# EAGLE design EmbeddedSystem_BackplaneV1 (EAGLE 7.1.0)
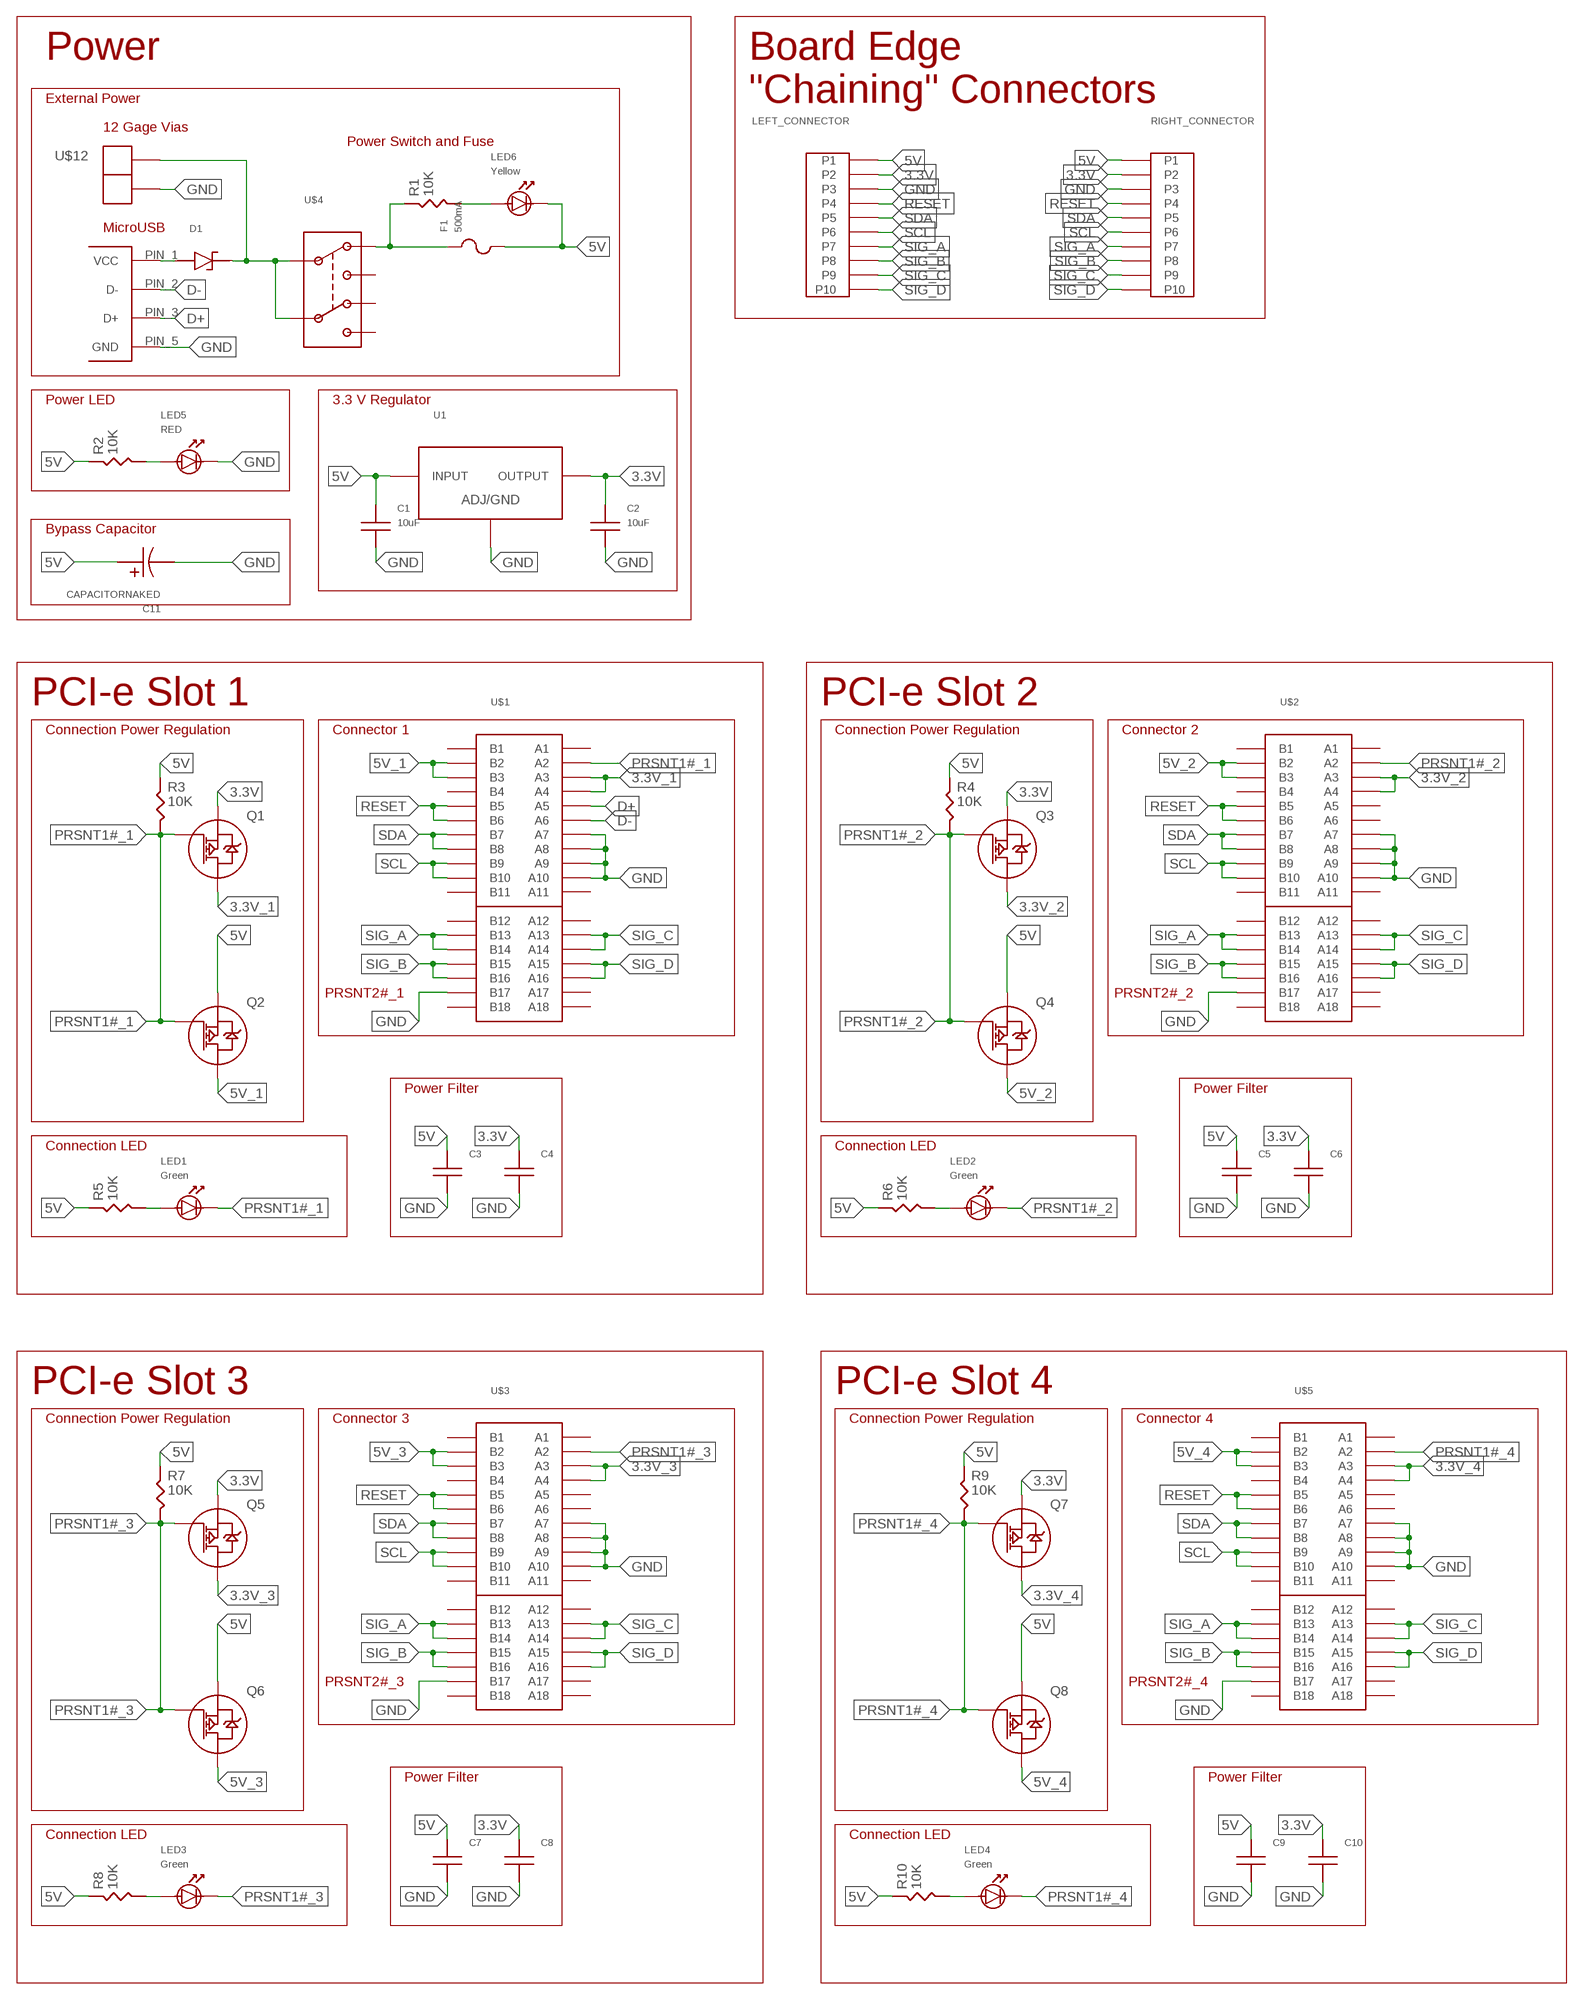
[diagram p0: schematic, sheet 1]

## Parts
C1  10uF  CAPACITOR-UNPOLARIZED0805  [0805_STACKPOLERESISTOR]
C2  10uF  CAPACITOR-UNPOLARIZED0805  [0805_STACKPOLERESISTOR]
C3  CAPACITOR-UNPOLARIZED0805  [0805_STACKPOLERESISTOR]
C4  CAPACITOR-UNPOLARIZED0805  [0805_STACKPOLERESISTOR]
C5  CAPACITOR-UNPOLARIZED0805  [0805_STACKPOLERESISTOR]
C6  CAPACITOR-UNPOLARIZED0805  [0805_STACKPOLERESISTOR]
C7  CAPACITOR-UNPOLARIZED0805  [0805_STACKPOLERESISTOR]
C8  CAPACITOR-UNPOLARIZED0805  [0805_STACKPOLERESISTOR]
C9  CAPACITOR-UNPOLARIZED0805  [0805_STACKPOLERESISTOR]
C10  CAPACITOR-UNPOLARIZED0805  [0805_STACKPOLERESISTOR]
C11  CAPACITORNAKED  [ESK_H4_CAPACITOR_NAKED]
D1  DIODE_SCHOTTKYSOD-123  [SOD-123]
F1  500mA  FUSEC1Q_SMD  [TYPE_C1Q_FUSE]
LED1  Green  LED  [0805_LED]
LED2  Green  LED  [0805_LED]
LED3  Green  LED  [0805_LED]
LED4  Green  LED  [0805_LED]
LED5  RED  LED  [0805_LED]
LED6  Yellow  LED  [0805_LED]
LEFT_CONNECTOR  10PIN-HEADER  [10PIN_HEADER]
Q1  PMOSSOT-23  [SOT-23]
Q2  PMOSSOT-23  [SOT-23]
Q3  PMOSSOT-23  [SOT-23]
Q4  PMOSSOT-23  [SOT-23]
Q5  PMOSSOT-23  [SOT-23]
Q6  PMOSSOT-23  [SOT-23]
Q7  PMOSSOT-23  [SOT-23]
Q8  PMOSSOT-23  [SOT-23]
R1  10K  RESISTOR  [0805_STACKPOLERESISTOR]
R2  10K  RESISTOR  [0805_STACKPOLERESISTOR]
R3  10K  RESISTOR  [0805_STACKPOLERESISTOR]
R4  10K  RESISTOR  [0805_STACKPOLERESISTOR]
R5  10K  RESISTOR  [0805_STACKPOLERESISTOR]
R6  10K  RESISTOR  [0805_STACKPOLERESISTOR]
R7  10K  RESISTOR  [0805_STACKPOLERESISTOR]
R8  10K  RESISTOR  [0805_STACKPOLERESISTOR]
R9  10K  RESISTOR  [0805_STACKPOLERESISTOR]
R10  10K  RESISTOR  [0805_STACKPOLERESISTOR]
RIGHT_CONNECTOR  10PIN-HEADER  [10PIN_HEADER]
U1  VOLTAGE_REGULATOR  [SOT223]
U$1  PCI-E_X1  [PCIE_X1]
U$2  PCI-E_X1  [PCIE_X1]
U$3  PCI-E_X1  [PCIE_X1]
U$4  SWITCH_DPDT  [SWITCH_GF-126]
U$5  PCI-E_X1  [PCIE_X1]
U$10  USBMICROB  [USBMICROB-PAC]
U$12  2PIN-HEADER16GAGE  [2PIN_16GAGE]

## Nets
3.3V: C2.P$1 C4.P$1 C6.P$1 C8.P$1 C10.P$1 LEFT_CONNECTOR.P2 Q1.S Q3.S Q5.S Q7.S RIGHT_CONNECTOR.P2 U1.P2(OUTPUT) U1.TOP(OUTPUT)
3.3V_1: Q1.D U$1.A3 U$1.A4
3.3V_2: Q3.D U$2.A3 U$2.A4
3.3V_3: Q5.D U$3.A3 U$3.A4
3.3V_4: Q7.D U$5.A3 U$5.A4
5V: C1.P$1 C3.P$1 C5.P$1 C7.P$1 C9.P$1 C11.POSITIVE_PAD(POSITIVE_LEAD) F1.P$2 LED6.CATHODE LEFT_CONNECTOR.P1 Q2.S Q4.S Q6.S Q8.S R2.P$1 R3.P$1 R4.P$1 R5.P$1 R6.P$1 R7.P$1 R8.P$1 R9.P$1 R10.P$1 RIGHT_CONNECTOR.P1 U1.P3(INPUT)
5V_1: Q2.D U$1.B2 U$1.B3
5V_2: Q4.D U$2.B2 U$2.B3
5V_3: Q6.D U$3.B2 U$3.B3
5V_4: Q8.D U$5.B2 U$5.B3
5V_SUPPLY: D1.CATHODE U$4.P1_C U$4.P2_C U$12.P1
D+: U$1.A5 U$10.PIN_3(D+)
D-: U$1.A6 U$10.PIN_2(D-)
GND: C1.P$2 C2.P$2 C3.P$2 C4.P$2 C5.P$2 C6.P$2 C7.P$2 C8.P$2 C9.P$2 C10.P$2 C11.NEGATIVE_PAD(NEGATIVE_LEAD) LED5.CATHODE LEFT_CONNECTOR.P3 RIGHT_CONNECTOR.P3 U1.P1(ADJ/GND) U$1.A7 U$1.A8 U$1.A9 U$1.A10 U$1.B17 U$2.A7 U$2.A8 U$2.A9 U$2.A10 U$2.B17 U$3.A7 U$3.A8 U$3.A9 U$3.A10 U$3.B17 U$5.A7 U$5.A8 U$5.A9 U$5.A10 U$5.B17 U$10.PIN_5(GND) U$12.P2
N$1: LED5.ANODE R2.P$2
N$2: F1.P$1 R1.P$1 U$4.P1_1
N$3: LED6.ANODE R1.P$2
N$4: LED1.ANODE R5.P$2
N$5: D1.ANODE U$10.PIN_1(VCC)
N$6: LED2.ANODE R6.P$2
N$7: LED3.ANODE R8.P$2
N$8: LED4.ANODE R10.P$2
PRSNT1#_1: LED1.CATHODE Q1.G(G(1)) Q2.G(G(1)) R3.P$2 U$1.A2
PRSNT1#_2: LED2.CATHODE Q3.G(G(1)) Q4.G(G(1)) R4.P$2 U$2.A2
PRSNT1#_3: LED3.CATHODE Q5.G(G(1)) Q6.G(G(1)) R7.P$2 U$3.A2
PRSNT1#_4: LED4.CATHODE Q7.G(G(1)) Q8.G(G(1)) R9.P$2 U$5.A2
RESET: LEFT_CONNECTOR.P4 RIGHT_CONNECTOR.P4 U$1.B5 U$1.B6 U$2.B5 U$2.B6 U$3.B5 U$3.B6 U$5.B5 U$5.B6
SCL: LEFT_CONNECTOR.P6 RIGHT_CONNECTOR.P6 U$1.B9 U$1.B10 U$2.B9 U$2.B10 U$3.B9 U$3.B10 U$5.B9 U$5.B10
SDA: LEFT_CONNECTOR.P5 RIGHT_CONNECTOR.P5 U$1.B7 U$1.B8 U$2.B7 U$2.B8 U$3.B7 U$3.B8 U$5.B7 U$5.B8
SIG_A: LEFT_CONNECTOR.P7 RIGHT_CONNECTOR.P7 U$1.B13 U$1.B14 U$2.B13 U$2.B14 U$3.B13 U$3.B14 U$5.B13 U$5.B14
SIG_B: LEFT_CONNECTOR.P8 RIGHT_CONNECTOR.P8 U$1.B15 U$1.B16 U$2.B15 U$2.B16 U$3.B15 U$3.B16 U$5.B15 U$5.B16
SIG_C: LEFT_CONNECTOR.P9 RIGHT_CONNECTOR.P9 U$1.A13 U$1.A14 U$2.A13 U$2.A14 U$3.A13 U$3.A14 U$5.A13 U$5.A14
SIG_D: LEFT_CONNECTOR.P10 RIGHT_CONNECTOR.P10 U$1.A15 U$1.A16 U$2.A15 U$2.A16 U$3.A15 U$3.A16 U$5.A15 U$5.A16
Unconnected: U$1.A1 U$1.A11 U$1.A12 U$1.A17 U$1.A18 U$1.B1 U$1.B4 U$1.B11 U$1.B12 U$1.B18 U$2.A1 U$2.A5 U$2.A6 U$2.A11 U$2.A12 U$2.A17 U$2.A18 U$2.B1 U$2.B4 U$2.B11 U$2.B12 U$2.B18 U$3.A1 U$3.A5 U$3.A6 U$3.A11 U$3.A12 U$3.A17 U$3.A18 U$3.B1 U$3.B4 U$3.B11 U$3.B12 U$3.B18 U$4.P1_2 U$4.P2_1 U$4.P2_2 U$5.A1 U$5.A5 U$5.A6 U$5.A11 U$5.A12 U$5.A17 U$5.A18 U$5.B1 U$5.B4 U$5.B11 U$5.B12 U$5.B18

## Notes on the sheet
- Power
- External Power
- Board Edge
  "Chaining" Connectors
- 12 Gage Vias
- Power Switch and Fuse
- MicroUSB
- Power LED | 3.3 V Regulator
- Bypass Capacitor
- PCI-e Slot 1 | PCI-e Slot 2
- Connection Power Regulation | Connector 1 | Connection Power Regulation | Connector 2
- PRSNT2#_1 | PRSNT2#_2
- Power Filter | Power Filter
- Connection LED | Connection LED
- PCI-e Slot 3 | PCI-e Slot 4
- Connection Power Regulation | Connector 3 | Connection Power Regulation | Connector 4
- PRSNT2#_3 | PRSNT2#_4
- Power Filter | Power Filter
- Connection LED | Connection LED

## Library data of the parts
C1-C10 = 000_CustomPartsMaster:CAPACITOR-UNPOLARIZED
C11 = 000_CustomPartsMaster:CAPACITOR
D1 = 000_CustomPartsMaster:DIODE_SCHOTTKY
F1 = 000_CustomPartsMaster:FUSE
LED1-LED6 = 000_CustomPartsMaster:LED
LEFT_CONNECTOR RIGHT_CONNECTOR = 000_CustomPartsMaster:10PIN-HEADER
Q1-Q8 = 000_CustomPartsMaster:PMOS
R1-R10 = 000_CustomPartsMaster:RESISTOR
U1 = 000_CustomPartsMaster:VOLTAGE_REGULATOR
U$1-U$3 U$5 = 000_CustomPartsMaster:PCI-E_X1
U$4 = 000_CustomPartsMaster:SWITCH_DPDT
U$10 = 000_CustomPartsMaster:USBMICROB
U$12 = 000_CustomPartsMaster:2PIN-HEADER

## Board
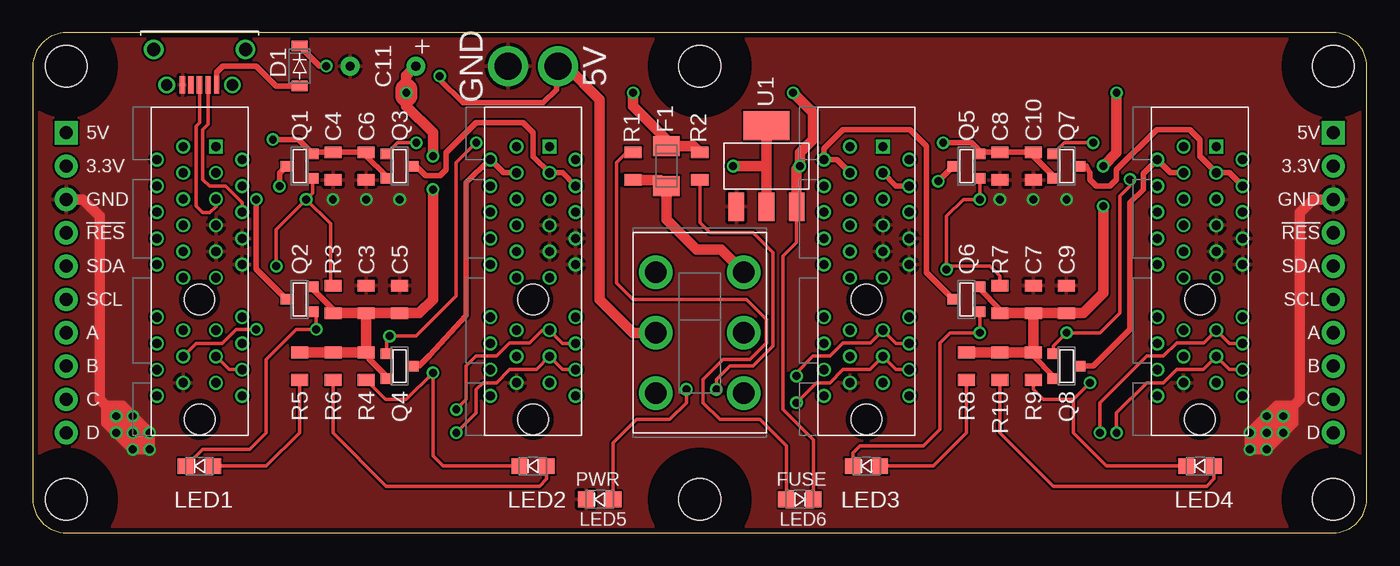
[diagram p1: board, top side]
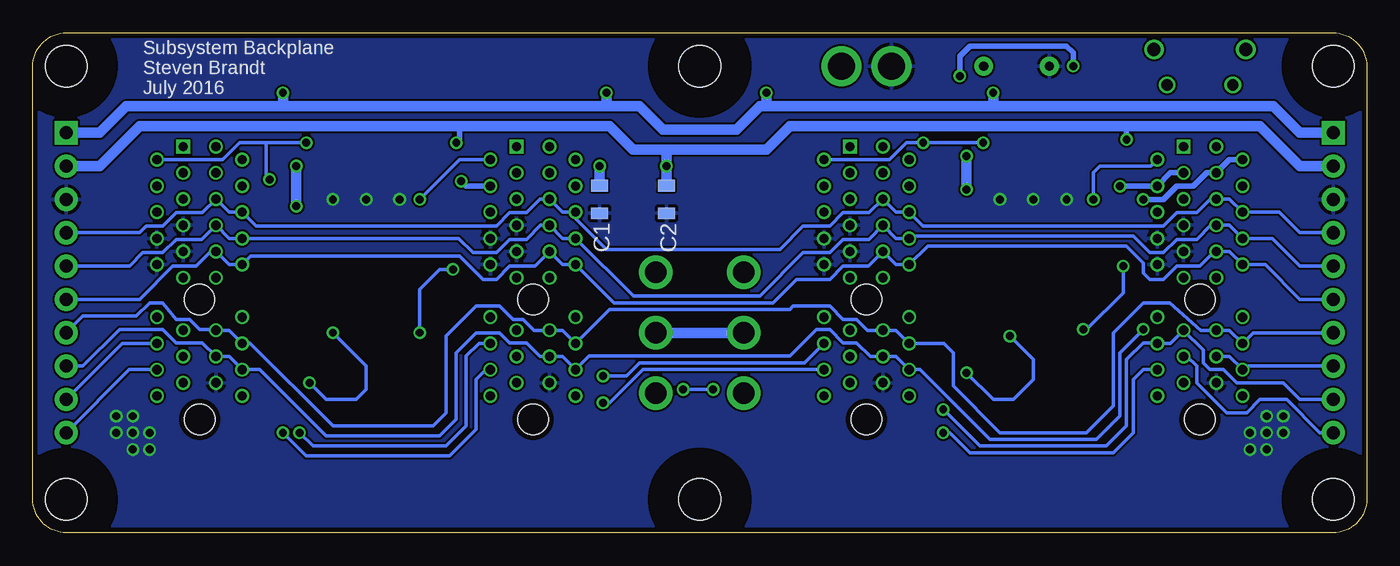
[diagram p2: board, bottom side, seen from below]

Size 101.6 x 38.1 mm. Coordinates in mm from the lower left corner, seen from the top.
Outline: 0,35.56 0,2.54 arc90 2.54,0 99.06,0 arc90 101.6,2.54 101.6,35.56 arc90 99.06,38.1 2.54,38.1 arc90 0,35.56
Copper layers (1*16): Top 0.0356mm / dielectric 1.5011mm / Bottom 0.0356mm
Design rules "oshpark-2layer": minimum track width 6mil, minimum drill 13mil, track to track 6mil, track to pad 6mil, pad to pad 6mil, via to via 6mil, smd to smd 6mil, copper to edge 15mil, drill to drill 6mil, minimum pad ring 7mil, minimum via ring 7mil, stop-mask expansion 4mil, vias tented up to drill 0mil, thermal gap 10mil
Holes 3.17 mm at 2.54,2.54 2.54,35.56 99.06,35.56 99.06,2.54 50.8,2.54 50.8,35.56
tRestrict: area -1.3,31.8 to 6.3,39.4; area -1.3,-1.3 to 6.3,6.3; area 95.2,-1.3 to 102.9,6.3; area 95.2,31.8 to 102.9,39.4; area 47,-1.3 to 54.6,6.3; area 47,31.8 to 54.6,39.4
bRestrict: area -1.3,31.8 to 6.3,39.4; area -1.3,-1.3 to 6.3,6.3; area 95.2,-1.3 to 102.9,6.3; area 95.2,31.8 to 102.9,39.4; area 47,-1.3 to 54.6,6.3; area 47,31.8 to 54.6,39.4

### Footprints (pad centres in the part's own frame; a part is rotated, then mirrored left to right if it is on the bottom)
0805_STACKPOLERESISTOR = smd 0.9 x 1.3: P$1 -1.05,0; P$2 1.05,0
ESK_H4_CAPACITOR_NAKED = drill 0.7 pad 1.422: NEGATIVE_PAD -2.5,0; POSITIVE_PAD 2.5,0
SOD-123 = smd 1.2 x 0.8: ANODE 0,-1.525; CATHODE 0,1.525
TYPE_C1Q_FUSE = smd 1.52 x 2.03: P$1 -1.52,0; P$2 1.52,0
0805_LED = smd 1.2 x 1.2: ANODE -1.05,0; CATHODE 1.05,0
10PIN_HEADER = drill 1 pad 1.778 square: P1 0,11.43 | drill 1 pad 1.778: P2 0,8.89; P3 0,6.35; P4 0,3.81; P5 0,1.27; P6 0,-1.27; P7 0,-3.81; P8 0,-6.35; P9 0,-8.89; P10 0,-11.43
SOT-23 = smd 0.8 x 0.9: D 0,1; G -0.95,-1; S 0.95,-1
SOT223 = smd 1.2 x 2.2: P1 -2.3,-3.1; P2 0,-3.1; P3 2.3,-3.1 | smd 3.5 x 2.2: TOP 0,3.1
PCIE_X1 = drill 0.7 pad 1.016 square: A1 -11.65,1.25 | drill 0.7 pad 1.016: A2 -10.65,3.25; A3 -9.65,1.25; A4 -8.65,3.25; A5 -7.65,1.25; A6 -6.65,3.25; A7 -5.65,1.25; A8 -4.65,3.25; A9 -3.65,1.25; A10 -2.65,3.25; A12 1.35,3.25; A13 2.35,1.25; A14 3.35,3.25; A15 4.35,1.25; A16 5.35,3.25; A17 6.35,1.25; A18 7.35,3.25; B1 -11.65,-1.25; B2 -10.65,-3.25; B3 -9.65,-1.25; B4 -8.65,-3.25; B5 -7.65,-1.25; B6 -6.65,-3.25; B7 -5.65,-1.25; B8 -4.65,-3.25; B9 -3.65,-1.25; B10 -2.65,-3.25; B12 1.35,-3.25; B13 2.35,-1.25; B14 3.35,-3.25; B15 4.35,-1.25; B16 5.35,-3.25; B17 6.35,-1.25; B18 7.35,-3.25 | drill 0.7 pad 0.965: A11 -1.65,1.25; B11 -1.65,-1.25 | hole 2.311: 0,0 | hole 2.35: 9.15,0
SWITCH_GF-126 = drill 1.65 pad 2.54: P1_1 -4.6,3.355; P1_2 4.6,3.355; P1_C 0,3.355; P2_1 -4.6,-3.355; P2_2 4.6,-3.355; P2_C 0,-3.355
USBMICROB-PAC = drill 1: P$1 0,3.5; P$2 0,-3.5 | drill 0.85: P$3 2.7,2.5; P$4 2.7,-2.5 | smd 1.35 x 0.4: PIN_1 2.7,1.3; PIN_2 2.7,0.65; PIN_3 2.7,0; PIN_4 2.7,-0.65; PIN_5 2.7,-1.3
2PIN_16GAGE = drill 2.057: P1 0,1.905; P2 0,-1.905

### Placement (x,y rotation side)
C1  58.42,25.4 270 bottom
C2  53.34,25.4 270 bottom
C3  25.4,17.78 90 top
C4  22.86,27.94 270 top
C5  27.94,17.78 90 top
C6  25.4,27.94 270 top
C7  76.2,17.78 90 top
C8  73.66,27.94 270 top
C9  78.74,17.78 90 top
C10  76.2,27.94 270 top
C11  26.67,35.56 0 top
D1  20.32,35.56 0 top
F1  48.26,27.94 90 top
LED1  12.7,5.08 180 top
LED2  38.1,5.08 180 top
LED3  63.5,5.08 180 top
LED4  88.9,5.08 180 top
LED5  43.18,2.54 180 top
LED6  58.42,2.54 0 top
LEFT_CONNECTOR  2.54,19.05 0 top
Q1  20.32,27.94 90 top
Q2  20.32,17.78 90 top
Q3  27.94,27.94 270 top
Q4  27.94,12.7 270 top
Q5  71.12,27.94 90 top
Q6  71.12,17.78 90 top
Q7  78.74,27.94 270 top
Q8  78.74,12.7 270 top
R1  45.72,27.94 90 top
R2  50.8,27.94 270 top
R3  22.86,17.78 90 top
R4  25.4,12.7 270 top
R5  20.32,12.7 270 top
R6  22.86,12.7 270 top
R7  73.66,17.78 90 top
R8  71.12,12.7 270 top
R9  76.2,12.7 270 top
R10  73.66,12.7 270 top
RIGHT_CONNECTOR  99.06,19.05 0 top
U1  55.88,27.94 0 top
U$1  12.7,17.78 270 top
U$2  38.1,17.78 270 top
U$3  63.5,17.78 270 top
U$4  50.8,15.24 270 top
U$5  88.9,17.78 270 top
U$10  12.7,36.83 270 top
U$12  38.1,35.56 270 top

### Tracks (layer width: path | path; a pad name or v marks a point on that pad's centre or on a via)
3.3V  (via drill 0.6)
  Top 0.406: Q3.S 26.94,27.16 25.4,28.7 C6.P$1 C4.P$1 21.42,28.99 Q1.S 20.24,29.97 v18.29,29.97 | Q5.S 72.22,28.99 | 72.22,28.99 C8.P$1 C10.P$1 76.2,28.7 77.74,27.16 Q7.S | 72.22,28.99 71.49,29.72 v69.34,29.72
  Top 0.813: U1.TOP 55.88,27.94 | 55.88,27.94 U1.P2 | v53.34,27.94 55.88,27.94
  Bottom 0.406: v18.29,29.97 18.29,30.99 | v69.34,29.72 69.09,29.97 69.09,30.99
  Bottom 0.813: LEFT_CONNECTOR.P2 5.08,27.94 8.13,30.99 18.29,30.99 43.94,30.99 45.72,29.21 53.34,29.21 | RIGHT_CONNECTOR.P2 96.52,27.94 93.47,30.99 69.09,30.99 57.66,30.99 55.88,29.21 53.34,29.21 | C2.P$1 v53.34,27.94 53.34,29.21
3.3V_1  (via drill 0.6)
  Top 0.406: v18.8,26.42 18.8,27.42 Q1.D
  Bottom 0.406: v18.8,26.42 18.78,26.43 U$1.A4 14.95,27.43 U$1.A3
3.3V_2
  Top 0.406: U$2.A4 40.35,27.43 U$2.A3 38.1,28.68 38.1,30.48 37.34,31.24 33.78,31.24 31.5,28.96 31.5,27.69 31.03,27.22 29.93,27.22 29.21,27.94 Q3.D
3.3V_3  (via drill 0.6)
  Top 0.406: U$3.A3 65.75,26.43 U$3.A4 | v68.97,26.79 Q5.D
  Bottom 0.406: U$3.A4 68.61,26.43 v68.97,26.79
3.3V_4
  Top 0.406: U$5.A4 91.15,27.43 U$5.A3 88.9,28.7 88.9,29.97 88.14,30.73 85.6,30.73 82.55,27.69 82.55,26.92 82.04,26.42 81.03,26.42 80.52,26.92 80.52,27.43 80.26,27.94 Q7.D
5V  (via drill 0.6)
  Top 0.254: LED6.CATHODE 59.47,7.08 57.15,9.4 57.15,21.08 58.17,22.1 58.17,24.83 U1.P3
  Top 0.406: R4.P$1 25.59,13.75 25.59,13.27 26.94,11.92 Q4.S | R3.P$1 22.86,17.02 21.32,18.56 Q2.S | Q8.S 77.74,11.92 76.2,13.46 R9.P$1 | Q6.S 72.12,18.56 73.66,17.02 R7.P$1
  Top 0.813: C3.P$1 C5.P$1 29.43,16.73 30.48,17.78 v30.48,26.16 | C3.P$1 R3.P$1 | R5.P$1 R6.P$1 R4.P$1 C3.P$1 | v30.48,28.7 30.48,30.48 28.45,32.51 28.45,33.27 v28.45,33.53 28.45,33.78 28.45,34.84 C11.POSITIVE_PAD | R7.P$1 C7.P$1 | C7.P$1 C9.P$1 78.77,16.76 80.01,16.76 81.53,18.29 v81.53,24.89 | R8.P$1 R10.P$1 R9.P$1 C7.P$1 | v81.53,27.94 82.55,28.96 v82.55,33.53 | v57.91,33.53 59.44,32 59.44,29.97 58.42,28.96 v58.42,27.94 58.18,27.7 U1.P3 | R2.P$1 50.33,29.46 F1.P$2 48.26,29.97 45.72,32.51 v45.72,33.53
  Top 1.676: 28.45,33.78 28.45,33.27
  Bottom 0.813: 28.45,32.51 7.11,32.51 5.08,30.48 LEFT_CONNECTOR.P1 | 28.45,32.51 45.72,32.51 | 58.17,32.51 82.55,32.51 | 82.55,32.51 94.49,32.51 96.52,30.48 RIGHT_CONNECTOR.P1 | v30.48,26.16 v30.48,28.7 | v81.53,24.89 v81.53,27.94 | v82.55,33.53 82.55,32.51 | v45.72,33.53 45.72,32.51 | v57.91,33.53 57.91,32.77 58.17,32.51 | v58.42,27.94 C1.P$1 | 45.72,32.51 46.23,32.51 48.01,30.73 53.59,30.73 55.37,32.51 58.17,32.51 | v28.45,33.53 28.45,32.51
5V_1  (via drill 0.6)
  Top 0.406: Q2.D 17.02,20.08 v17.02,25.4
  Bottom 0.406: U$1.B2 10.45,28.43 U$1.B3 12.19,27.43 13.21,26.42 14.48,26.42 15.49,25.4 v17.02,25.4
5V_2
  Top 0.406: U$2.B3 35.85,27.43 U$2.B2 34.78,28.43 33.02,26.67 33.02,16.56 30.23,13.5 29.43,12.7 Q4.D
5V_3
  Top 0.406: Q6.D 68.07,19.83 68.07,29.46 66.8,30.73 61.72,30.73 60.25,29.26 U$3.B2 61.25,28.43 U$3.B3
5V_4
  Top 0.406: U$5.B3 86.65,27.43 U$5.B2 84.58,27.36 84.58,26.16 83.57,25.15 83.57,15.49 80.77,12.7 Q8.D
5V_SUPPLY  (via drill 0.6)
  Top 0.406: v30.99,34.8 30.99,34.54 32.77,32.77 38.86,32.77 39.88,33.78 39.88,35.43 U$12.P1 | D1.CATHODE 21.84,35.56 v22.35,35.56
  Top 0.813: U$12.P1 40.64,35.56 43.18,33.02 43.18,17.78 45.72,15.24 U$4.P2_C
  Bottom 0.406: v30.99,34.8 30.99,36.32 30.23,37.08 22.86,37.08 22.35,36.58 v22.35,35.56
  Bottom 0.813: U$4.P2_C U$4.P1_C
D+
  Top 0.254: U$10.PIN_3 12.7,31.24 12.45,30.99 12.45,24.89 12.95,24.38 13.46,24.38 13.95,24.87 U$1.A5
D-
  Top 0.254: U$1.A6 15.95,25.15 14.68,26.42 13.46,26.42 12.95,26.92 12.95,30.73 13.35,31.13 U$10.PIN_2
GND  (via drill 0.6)
  Top 0.813: RIGHT_CONNECTOR.P3 97.54,25.4 96.52,24.38 96.52,10.16 96.01,9.65 | LEFT_CONNECTOR.P3 3.81,25.4 5.08,24.13 5.08,10.16 5.59,9.65 | 96.01,9.65 v95.25,8.89 | v95.25,8.89 v93.98,8.89 | v95.25,8.89 v95.25,7.62 | v93.98,8.89 v92.71,7.62 v92.71,6.35 | v95.25,7.62 v93.98,6.35 v92.71,6.35 | v92.71,6.35 v95.25,8.89 | 92.96,7.37 94.23,8.64 | 93.73,6.6 95,7.87 | v93.98,8.89 94.74,9.65 96.01,9.65 | 96.01,9.65 96.01,8.38 v95.25,7.62 | 5.59,9.65 v6.35,8.89 | v6.35,8.89 v6.35,7.62 | v6.35,8.89 v7.62,8.89 | v6.35,7.62 v7.62,6.35 v8.89,6.35 | v7.62,8.89 v8.89,7.62 v8.89,6.35 | v8.89,6.35 v6.35,8.89 | 7.87,6.6 6.6,7.87 | 8.64,7.37 7.37,8.64 | v6.35,7.62 5.59,8.38 5.59,9.65 | 5.59,9.65 6.86,9.65 v7.62,8.89
  other vias: 93.98,7.62 7.62,7.62 73.66,25.4 76.2,25.4 78.74,25.4 22.86,25.4 25.4,25.4 27.94,25.4
  pour Top: -2.54,40.64 104.14,40.64 104.14,-2.54 -2.54,-2.54
  pour Bottom: -5.08,43.18 106.68,43.18 106.68,-5.08 -5.08,-5.08 -5.08,40.64
N$1  (via drill 0.6)
  Top 0.254: R2.P$2 50.8,23.62 51.56,22.86 54.86,22.86 56.39,21.34 56.39,14.22 54.86,12.7 53.09,12.7 52.07,11.68 v52.07,10.92 | v49.78,10.92 49.78,9.91 48.51,8.64 45.97,8.64 44.2,6.86 44.2,2.57 LED5.ANODE
  Bottom 0.254: v52.07,10.92 v49.78,10.92
N$2
  Top 0.813: U$4.P1_1 52.41,21.59 50.55,21.59 48.26,23.88 F1.P$1 47.79,26.89 R1.P$1
N$3
  Top 0.254: R1.P$2 45.25,28.99 44.45,28.19 44.45,19.05 45.72,17.78 54.36,17.78 55.88,16.26 55.88,14.48 54.61,13.21 52.58,13.21 51.05,11.68 51.05,9.91 52.32,8.64 55.37,8.64 57.4,6.6 57.4,2.57 LED6.ANODE
N$4
  Top 0.254: R5.P$2 20.32,7.62 17.78,5.08 LED1.ANODE
N$5
  Top 0.406: U$10.PIN_1 14,35.08 14.48,35.56 17.02,35.56 18.54,34.04 D1.ANODE
N$6
  Top 0.254: R6.P$2 22.86,7.62 26.92,3.56 38.61,3.56 39.15,4.1 LED2.ANODE
N$7
  Top 0.254: R8.P$2 71.12,7.62 68.58,5.08 LED3.ANODE
N$8
  Top 0.254: LED4.ANODE 89.95,4.1 89.41,3.56 77.72,3.56 73.66,7.62 R10.P$2
PRSNT1#_1  (via drill 0.6)
  Top 0.254: R3.P$2 22.67,18.83 22.67,23.55 v20.82,25.4 | LED1.CATHODE 12.92,6.35 16.51,6.35 17.78,7.62 17.78,13.21 20.07,15.49 v21.59,15.49 21.59,16.56 Q2.G | Q1.G 21.32,25.9 v20.82,25.4 | v18.54,20.32 18.54,23.12 v20.82,25.4
  Bottom 0.254: U$1.A2 16.44,27.94 20.32,27.94 20.82,27.44 v20.82,25.4 | v21.59,15.49 21.34,15.49 18.54,18.29 v18.54,20.32
PRSNT1#_2  (via drill 0.6)
  Top 0.254: v33.78,29.72 32.26,28.19 32.26,18.03 29.21,14.99 v27.18,14.99 26.94,14.75 Q4.G | v29.21,29.72 27.77,29.72 Q3.G | R4.P$2 26.89,10.16 28.45,10.16 v30.48,12.19 30.48,5.84 31.24,5.08 LED2.CATHODE
  Bottom 0.254: v29.21,29.72 v33.78,29.72 35.05,29.72 36.34,28.43 U$2.A2 | v27.18,14.99 25.4,13.21 25.4,11.68 26.92,10.16 28.45,10.16 v30.48,12.19
PRSNT1#_3  (via drill 0.6)
  Top 0.254: LED3.CATHODE 62.48,5.11 62.48,6.1 62.99,6.6 67.82,6.6 69.09,7.87 69.09,14.48 69.85,15.24 v72.14,15.24 72.12,15.26 Q6.G | R7.P$2 73.66,19.56 72.9,20.32 69.85,20.32 v69.6,20.07 69.6,24.13 70.87,25.4 v72.14,25.4 72.12,25.42 Q5.G
  Bottom 0.254: v72.14,25.4 69.11,28.43 U$3.A2 | v69.6,20.07 70.61,20.07 72.14,18.54 v72.14,15.24
PRSNT1#_4  (via drill 0.6)
  Top 0.254: Q7.G 78.57,29.72 v80.77,29.72 | R9.P$2 76.2,10.92 76.96,10.16 79.25,10.16 | Q8.G 77.74,14.24 v78.74,15.24 81.28,15.24 82.8,16.76 82.8,25.65 83.57,26.42 v83.57,26.92 | LED4.CATHODE 81.79,5.08 79.25,7.62 79.25,10.16 | 79.25,10.16 v80.52,11.43
  Bottom 0.254: v80.77,29.72 83.82,29.72 | 83.82,29.72 85.85,29.72 87.12,28.45 87.63,28.45 87.65,28.43 U$5.A2 | v78.74,15.24 76.2,12.7 76.2,10.92 76.96,10.16 79.25,10.16 v80.52,11.43 | v83.57,26.92 83.82,27.18 83.82,29.72
RESET
  Bottom 0.254: LEFT_CONNECTOR.P4 5.08,22.86 6.65,24.43 U$1.B6 10.45,25.43 U$1.B5 11.91,25.43 12.95,24.38 14.48,24.38 15.49,23.37 33.79,23.37 U$2.B6 35.85,24.43 U$2.B5 37.9,24.38 39.88,24.38 40.89,23.37 42.93,23.37 44.7,21.59 57.91,21.59 60.25,23.93 U$3.B6 61.25,24.43 U$3.B5 62.96,25.43 64.01,24.38 65.28,24.38 66.29,23.37 84.59,23.37 U$5.B6 86.65,24.43 U$5.B5 88.7,24.38 90.68,24.38 91.69,23.37 92.96,23.37 93.47,22.86 RIGHT_CONNECTOR.P4
SCL
  Bottom 0.254: LEFT_CONNECTOR.P6 5.08,17.78 7.73,20.43 U$1.B10 10.45,21.43 U$1.B9 11.59,21.43 12.7,20.32 14.48,20.32 15.49,19.3 16.51,19.3 17.02,19.81 17.02,20.57 18.29,21.84 33.44,21.84 U$2.B10 35.85,20.43 U$2.B9 37.96,20.32 39.88,20.32 40.89,19.3 43.43,19.3 45.21,17.53 57.35,17.53 U$3.B10 61.25,20.43 U$3.B9 63.36,20.32 65.28,20.32 66.29,19.3 67.31,19.3 69.09,21.08 85,21.08 U$5.B10 86.65,20.43 U$5.B9 88.04,21.43 89.15,20.32 90.93,20.32 93.47,17.78 RIGHT_CONNECTOR.P6
SDA
  Bottom 0.254: LEFT_CONNECTOR.P5 5.08,20.32 7.19,22.43 U$1.B8 10.45,23.43 U$1.B7 11.88,23.43 12.95,22.35 14.48,22.35 15.49,21.34 16.51,21.34 17.78,22.61 34.67,22.61 U$2.B8 35.85,22.43 U$2.B7 37.93,22.35 39.88,22.35 40.89,21.34 42.93,21.34 46.23,18.03 55.85,18.03 U$3.B8 61.25,22.43 U$3.B7 62.93,23.43 64.01,22.35 65.28,22.35 66.29,21.34 68.07,21.34 69.17,22.43 U$5.B8 86.65,22.43 U$5.B7 88.73,22.35 90.68,22.35 91.69,21.34 93.22,21.34 94.23,20.32 RIGHT_CONNECTOR.P5
SIG_A
  Bottom 0.254: LEFT_CONNECTOR.P7 8.64,15.24 U$1.B14 10.45,15.43 U$1.B13 12.64,15.43 14.99,17.53 17.02,17.53 19.3,15.24 19.3,9.65 21.34,7.62 27.94,7.62 31.5,11.18 31.5,13.72 32.21,14.43 U$2.B14 35.85,15.43 U$2.B13 38.04,15.43 38.86,16.26 39.88,16.26 40.89,17.27 43.69,17.27 43.94,17.02 57.66,17.02 U$3.B14 61.25,15.43 U$3.B13 63.44,15.43 64.26,16.26 65.02,16.26 66.04,17.27 67.82,17.27 70.1,14.99 70.1,9.14 71.12,8.13 78.74,8.13 85.09,14.48 85.6,14.48 U$5.B14 86.65,15.43 U$5.B13 87.71,15.49 88.9,15.49 89.66,16.26 90.68,16.26 91.69,17.53 92.71,17.53 93.73,16.51 97.79,16.51 RIGHT_CONNECTOR.P7 98.81,15.49
SIG_B  (via drill 0.6)
  Top 0.254: v17.02,15.49 15.49,15.49 14.43,14.43 12.45,14.43 U$1.B15
  Bottom 0.254: LEFT_CONNECTOR.P8 9.18,12.7 U$1.B16 10.45,13.43 U$1.B15 | v17.02,15.49 18.8,13.72 18.8,8.89 20.57,7.11 28.7,7.11 34.02,12.43 U$2.B16 35.85,13.43 U$2.B15 37.81,13.43 38.86,14.48 39.88,14.48 40.89,15.49 41.91,15.49 43.94,13.46 59.22,13.46 U$3.B16 61.25,13.43 U$3.B15 62.96,13.43 64.01,14.48 65.28,14.48 66.04,15.24 67.82,15.24 69.34,13.72 69.34,8.64 70.61,7.37 79.25,7.37 84.31,12.43 U$5.B16 86.65,13.43 U$5.B15 88.7,14.48 90.68,14.48 91.69,15.49 95,15.49 97.79,12.7 RIGHT_CONNECTOR.P8
SIG_C  (via drill 0.6)
  Top 0.254: v32.26,9.4 33.02,10.16 33.02,12.7 33.78,13.46 35.31,13.46 36.32,14.48 37.85,14.48 38.8,15.43 U$2.A13 40.35,14.43 U$2.A14 | v58.17,11.94 58.17,12.19 59.44,13.46 60.71,13.46 61.72,14.48 63.8,14.48 U$3.A13 65.75,14.43 U$3.A14 | U$5.A14 91.15,14.43 U$5.A13 89.2,14.48 87.12,14.48 86.11,13.46 84.84,13.46 81.28,9.91 v81.28,7.62
  Bottom 0.254: v32.26,9.4 29.46,6.6 19.81,6.6 18.29,8.13 18.29,13.21 17.02,14.48 16,14.48 U$1.A14 14.95,14.43 U$1.A13 12.45,13.93 12.45,12.95 11.94,12.45 10.92,12.45 9.91,11.43 6.35,11.43 5.08,10.16 LEFT_CONNECTOR.P9 | U$3.A14 67.61,14.43 68.58,13.46 68.58,8.13 70.1,6.6 80.26,6.6 v81.28,7.62 | U$5.A14 94.79,14.43 RIGHT_CONNECTOR.P9 | v58.17,11.94 56.39,11.94 55.37,12.95 42.83,12.95 U$2.A14
SIG_D  (via drill 0.6)
  Top 0.254: U$1.A16 14.95,12.43 U$1.A15 | U$2.A16 40.35,12.43 U$2.A15 39.34,13.43 38.35,12.45 36.32,12.45 35.31,11.43 34.29,11.43 33.78,10.92 33.78,9.14 v32.26,7.62 | v58.17,9.91 59.69,11.43 60.71,11.43 61.72,12.45 63.77,12.45 U$3.A15 65.75,12.43 U$3.A16 | v82.55,7.62 82.55,9.14 84.84,11.43 86.11,11.43 87.12,12.45 89.17,12.45 U$5.A15 91.15,12.43 U$5.A16
  Bottom 0.254: U$1.A16 15.97,12.45 17.02,12.45 17.78,11.68 17.78,7.62 19.3,6.1 30.23,6.1 31.75,7.62 v32.26,7.62 | U$3.A16 67.07,12.43 67.82,11.68 67.82,7.87 69.85,5.84 80.77,5.84 v82.55,7.62 | U$5.A16 94.25,12.43 RIGHT_CONNECTOR.P10 | U$1.A15 13.68,13.43 12.95,12.7 12.95,11.43 10.67,9.14 9.14,9.14 8.13,10.16 6.1,10.16 3.56,7.62 LEFT_CONNECTOR.P10 | v58.17,9.91 57.66,9.91 55.12,12.45 41.37,12.45 U$2.A16

### Text on the board
tPlace: GND | 5V | 5V | 5V | 3.3V | 3.3V | GND | GND | !RES | !RES | SDA | SDA | SCL | SCL | A | A | B | B | C | C | D | D | PWR | FUSE
bPlace: Subsystem Backplane / Steven Brandt / July 2016